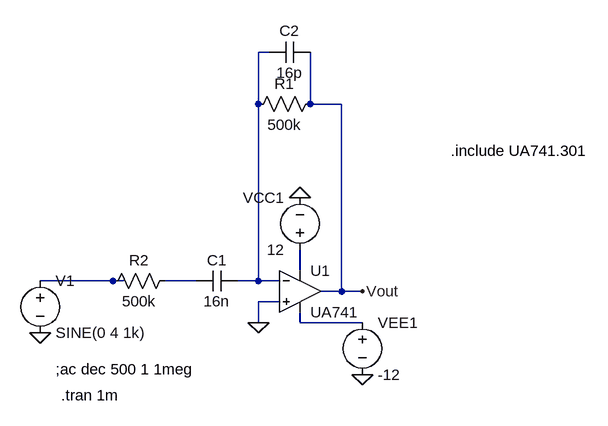
[diagram p0: schematic filter.asc]
filter.asc, the LTspice schematic file:
Version 4
SHEET 1 880 680
WIRE 144 -176 128 -176
WIRE 128 -96 128 -176
WIRE 208 -96 208 -176
WIRE 256 -96 208 -96
WIRE 192 160 192 128
WIRE -96 176 -208 176
WIRE -80 176 -96 176
WIRE 32 176 -16 176
WIRE 128 176 128 -96
WIRE 128 176 96 176
WIRE 160 176 128 176
WIRE 256 192 256 -96
WIRE 256 192 224 192
WIRE 288 192 256 192
WIRE 160 208 128 208
WIRE 128 240 128 208
WIRE 192 240 192 224
WIRE 288 240 192 240
FLAG 128 240 0
FLAG 288 192 Vout
FLAG 192 48 0
FLAG 288 320 0
FLAG -208 256 0
SYMBOL cap 96 160 R90
WINDOW 0 0 32 VBottom 2
WINDOW 3 32 32 VTop 2
SYMATTR InstName C1
SYMATTR Value 16n
SYMBOL res 224 -112 R90
WINDOW 0 0 56 VBottom 2
WINDOW 3 32 56 VTop 2
SYMATTR InstName R1
SYMATTR Value 500k
SYMBOL cap 208 -192 R90
WINDOW 0 -1 32 VBottom 2
WINDOW 3 32 32 VTop 2
SYMATTR InstName C2
SYMATTR Value 16p
SYMBOL res 0 160 R90
WINDOW 0 0 56 VBottom 2
WINDOW 3 32 56 VTop 2
SYMATTR InstName R2
SYMATTR Value 500k
SYMBOL voltage 192 144 R180
WINDOW 0 24 96 Left 2
WINDOW 3 24 16 Left 2
WINDOW 123 0 0 Left 0
WINDOW 39 0 0 Left 0
SYMATTR InstName VCC1
SYMATTR Value 12
SYMBOL voltage 288 224 R0
WINDOW 123 0 0 Left 0
WINDOW 39 0 0 Left 0
SYMATTR InstName VEE1
SYMATTR Value -12
SYMBOL OpAmps\\opamp2 192 128 R0
SYMATTR InstName U1
SYMATTR Value UA741
SYMBOL voltage -208 160 R0
WINDOW 123 0 0 Left 0
WINDOW 39 0 0 Left 0
SYMATTR InstName V1
SYMATTR Value SINE(0 4 1k)
TEXT -184 312 Left 2 !;ac dec 500 1 1meg
TEXT 424 -24 Left 2 !.include UA741.301
TEXT -176 352 Left 2 !.tran 1m

The netlist it stands for:
* filter.asc
C1 N001 N004 16n
R1 Vout N001 500k
C2 Vout N001 16p
R2 N004 N003 500k
VCC1 N002 0 12
VEE1 N005 0 -12
XU1 0 N001 N002 N005 Vout UA741  ; pins In+ In- V+ V- OUT
V1 N003 0 SINE(0 4 1k)
;ac dec 500 1 1meg
.include UA741.301
.tran 1m
.backanno
.end